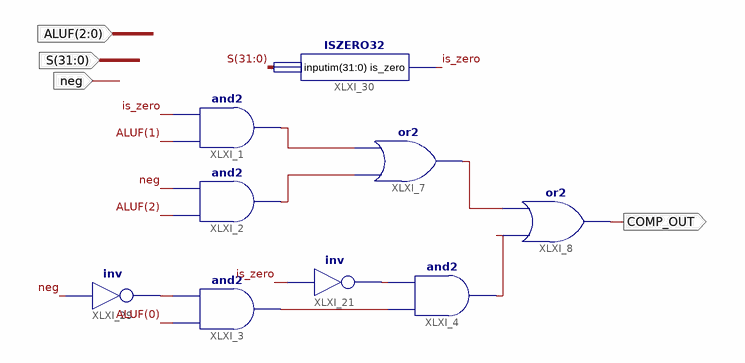
[diagram p0: schematic sheet 1]
// Xilinx ISE schematic COMPARATOR.sch (spartan6) as structural Verilog: 9 symbols, 4 ports
module COMPARATOR (
  input  [2:0] ALUF,
  input  neg,
  input  [31:0] S,
  output COMP_OUT
);

  wire is_zero, XLXN_8, XLXN_10, XLXN_11, XLXN_13, XLXN_15, XLXN_20, XLXN_21;

  and XLXI_3 (XLXN_11, ALUF[0], XLXN_8);
  and XLXI_4 (XLXN_15, XLXN_11, XLXN_10);
  not XLXI_21 (XLXN_10, is_zero);
  not XLXI_29 (XLXN_8, neg);
  or XLXI_7 (XLXN_13, XLXN_21, XLXN_20);
  and XLXI_2 (XLXN_21, ALUF[2], neg);
  and XLXI_1 (XLXN_20, ALUF[1], is_zero);
  or XLXI_8 (COMP_OUT, XLXN_15, XLXN_13);
  ISZERO32 XLXI_30 (.inputim(S), .is_zero(is_zero));
endmodule
